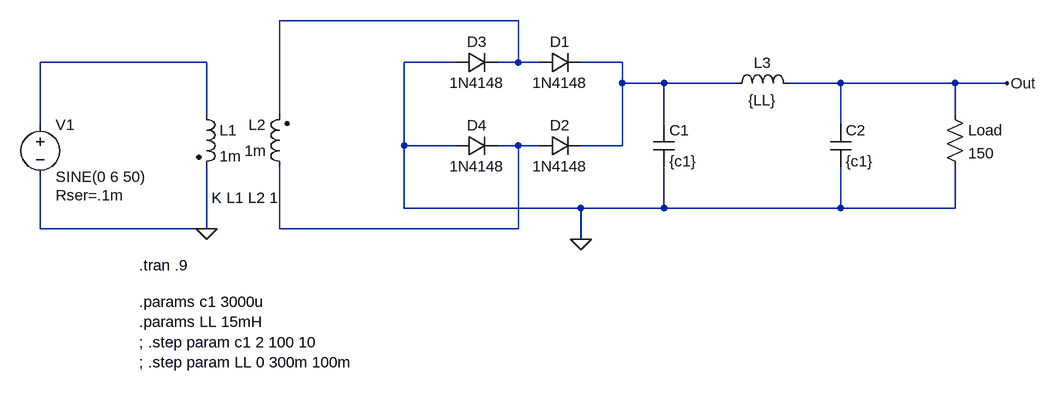
[diagram p0: schematic PiFilter-fullWaveRectifier1.asc]
PiFilter-fullWaveRectifier1.asc, the LTspice schematic file:
Version 4
SHEET 1 988 680
WIRE 176 -48 -192 -48
WIRE -304 16 -560 16
WIRE 80 16 0 16
WIRE 176 16 176 -48
WIRE 176 16 144 16
WIRE 208 16 176 16
WIRE 336 16 272 16
WIRE 336 48 336 16
WIRE 400 48 336 48
WIRE 512 48 400 48
WIRE 672 48 592 48
WIRE 848 48 672 48
WIRE 928 48 848 48
WIRE -304 96 -304 16
WIRE -192 96 -192 -48
WIRE 848 96 848 48
WIRE -560 112 -560 16
WIRE 400 112 400 48
WIRE 672 112 672 48
WIRE 0 144 0 16
WIRE 80 144 0 144
WIRE 176 144 144 144
WIRE 208 144 176 144
WIRE 336 144 336 48
WIRE 336 144 272 144
WIRE 0 240 0 144
WIRE 272 240 0 240
WIRE 400 240 400 176
WIRE 400 240 272 240
WIRE 672 240 672 176
WIRE 672 240 400 240
WIRE 848 240 848 176
WIRE 848 240 672 240
WIRE -560 272 -560 192
WIRE -304 272 -304 176
WIRE -304 272 -560 272
WIRE -192 272 -192 176
WIRE 176 272 176 144
WIRE 176 272 -192 272
WIRE 272 288 272 240
FLAG 272 288 0
FLAG -304 272 0
FLAG 928 48 Out
SYMBOL voltage -560 96 R0
WINDOW 123 0 0 Left 0
WINDOW 39 24 124 Left 2
SYMATTR SpiceLine Rser=.1m
SYMATTR InstName V1
SYMATTR Value SINE(0 6 50)
SYMBOL diode 208 32 R270
WINDOW 0 32 32 VTop 2
WINDOW 3 0 32 VBottom 2
SYMATTR InstName D1
SYMATTR Value 1N4148
SYMBOL diode 208 160 R270
WINDOW 0 32 32 VTop 2
WINDOW 3 0 32 VBottom 2
SYMATTR InstName D2
SYMATTR Value 1N4148
SYMBOL diode 80 32 R270
WINDOW 0 32 32 VTop 2
WINDOW 3 0 32 VBottom 2
SYMATTR InstName D3
SYMATTR Value 1N4148
SYMBOL diode 80 160 R270
WINDOW 0 32 32 VTop 2
WINDOW 3 0 32 VBottom 2
SYMATTR InstName D4
SYMATTR Value 1N4148
SYMBOL ind2 -320 80 R0
SYMATTR InstName L1
SYMATTR Value 1m
SYMATTR Type ind
SYMBOL ind2 -176 192 R180
WINDOW 0 36 80 Left 2
WINDOW 3 36 40 Left 2
SYMATTR InstName L2
SYMATTR Value 1m
SYMATTR Type ind
SYMBOL cap 384 112 R0
SYMATTR InstName C1
SYMATTR Value {c1}
SYMBOL cap 656 112 R0
SYMATTR InstName C2
SYMATTR Value {c1}
SYMBOL res 832 80 R0
SYMATTR InstName Load
SYMATTR Value 150
SYMBOL ind 496 64 R270
WINDOW 0 32 56 VTop 2
WINDOW 3 5 56 VBottom 2
SYMATTR InstName L3
SYMATTR Value {LL}
TEXT -408 328 Left 2 !.tran .9
TEXT -296 224 Left 2 !K L1 L2 1
TEXT -408 384 Left 2 !.params c1 3000u\n.params LL 15mH\n; .step param c1 2 100 10\n; .step param LL 0 300m 100m

The netlist it stands for:
* PiFilter-fullWaveRectifier1.asc
V1 N002 0 SINE(0 6 50) Rser=.1m
D1 N001 N003 1N4148
D2 N004 N003 1N4148
D3 0 N001 1N4148
D4 0 N004 1N4148
L1 N002 0 1m
L2 N004 N001 1m
C1 N003 0 {c1}
C2 Out 0 {c1}
R§Load Out 0 150
L3 N003 Out {LL}
.model D D
.lib standard.dio
.tran .9
K L1 L2 1
.params c1 3000u
.params LL 15mH
; .step param c1 2 100 10
; .step param LL 0 300m 100m
.backanno
.end